# EAGLE design lp_prog (EAGLE 7.5.0)
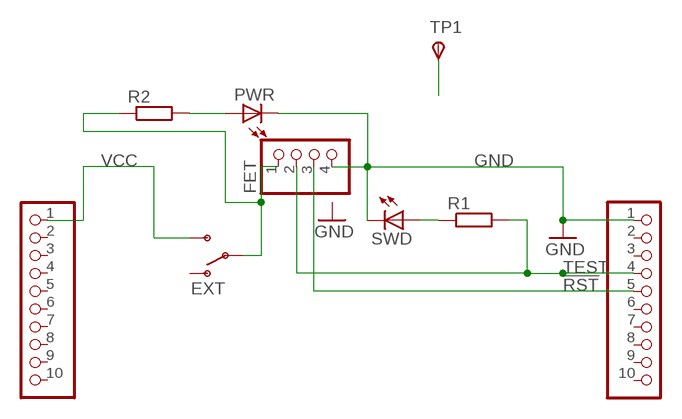
[diagram p0: schematic, sheet 1]

## Parts
FET  FET  PINHD-1X4  [1X04]
J1  J1  PINHD-1X10  [1X10]
J2  J2  PINHD-1X10  [1X10]
ON  EXT  SWITCH-SPSTPTH  [SWITCH-SPDT]
PWR  PWR  LEDCHIPLED_1206  [CHIPLED_1206]
R1  470  R-EU_R0805  [R0805]
R2  470  R-EU_R0805  [R0805]
SWD  SWD  LEDCHIPLED_1206  [CHIPLED_1206]
TP1  TPSTP20R  [TP20R]

## Nets
!RST: FET.3 J2.5
GND [GND]: FET.4 J2.1 PWR.C SWD.C
N$1: R1.1 SWD.A
N$2: PWR.A R2.2
N$4: TP1.TP(PP)
N$6 [VCC]: FET.1 ON.2(P) R2.1
TEST: FET.2 J2.4 R1.2
VCC [VCC]: J1.1 ON.3(S)
Unconnected: J1.2 J1.3 J1.4 J1.5 J1.6 J1.7 J1.8 J1.9 J1.10 J2.2 J2.3 J2.6 J2.7 J2.8 J2.9 J2.10 ON.1(O)

## Library data of the parts
FET = pinhead:PINHD-1X4: PIN HEADER
J1 J2 = pinhead:PINHD-1X10: PIN HEADER
ON = SparkFun:SWITCH-SPST: SPST Switch Simple slide switch. Spark Fun Electronics SKU : COM-00102
PWR SWD = led:LED: LED OSRAM: - CHIPLED LG R971, LG N971, LY N971, LG Q971, LY Q971, LO R971, LY R971 LH N974, LH R974 LS Q976, LO Q976, LY Q976 LO Q996 - Hyper CHIPLED LW Q18S LB Q993, LB Q99A, LB R99A - SideLED LS A670, LO A670, LY A670, LG A670, LP A670 LB A673, LV A673, LT A673, LW A673 LH A674 LY A675 LS A676, LA A676, LO A676, LY A676, LW A676 LS A679, LY A679, LG A679 - Hyper Micro SIDELED® LS Y876, LA Y876, LO Y876, LY Y876 LT Y87S - SmartLED LW L88C, LW L88S LB L89C, LB L89S, LG L890 LS L89K, LO L89K, LY L89K LS L896, LA L896, LO L896, LY L896 - TOPLED LS T670, LO T670, LY T670, LG T670, LP T670 LSG T670, LSP T670, LSY T670, LOP T670, LYG T670 LG T671, LOG T671, LSG T671 LB T673, LV T673, LT T673, LW T673 LH T674 LS T676, LA T676, LO T676, LY T676, LB T676, LH T676, LSB T676, LW T676 LB T67C, LV T67C, LT T67C, LS T67K, LO T67K, LY T67K, LW E67C LS E67B, LA E67B, LO E67B, LY E67B, LB E67C, LV E67C, LT E67C LW T67C LS T679, LY T679, LG T679 LS T770, LO T770, LY T770, LG T770, LP T770 LB T773, LV T773, LT T773, LW T773 LH T774 LS E675, LA E675, LY E675, LS T675 LS T776, LA T776, LO T776, LY T776, LB T776 LHGB T686 LT T68C, LB T68C - Hyper Mini TOPLED® LB M676 - Mini TOPLED Santana® LG M470 LS M47K, LO M47K, LY M47K Source: http://www.osram.convergy.de LUXEON: - LUMILED® LXK2-PW12-R00, LXK2-PW12-S00, LXK2-PW14-U00, LXK2-PW14-V00 LXK2-PM12-R00, LXK2-PM12-S00, LXK2-PM14-U00 LXK2-PE12-Q00, LXK2-PE12-R00, LXK2-PE12-S00, LXK2-PE14-T00, LXK2-PE14-U00 LXK2-PB12-K00, LXK2-PB12-L00, LXK2-PB12-M00, LXK2-PB14-N00, LXK2-PB14-P00, LXK2-PB14-Q00 LXK2-PR12-L00, LXK2-PR12-M00, LXK2-PR14-Q00, LXK2-PR14-R00 LXK2-PD12-Q00, LXK2-PD12-R00, LXK2-PD12-S00 LXK2-PH12-R00, LXK2-PH12-S00 LXK2-PL12-P00, LXK2-PL12-Q00, LXK2-PL12-R00 Source: www.luxeon.com KINGBRIGHT: KA-3528ASYC Source: www.kingbright.com
R1 R2 = resistor:R-EU_: RESISTOR, European symbol
TP1 = testpad:TPS: TEST PIN

## Net classes
0 default: width 0.508 mm, drill 0.508 mm
1 GND: width 0.813 mm, drill 0.508 mm
2 VCC: width 0.813 mm, drill 0.508 mm

## Board
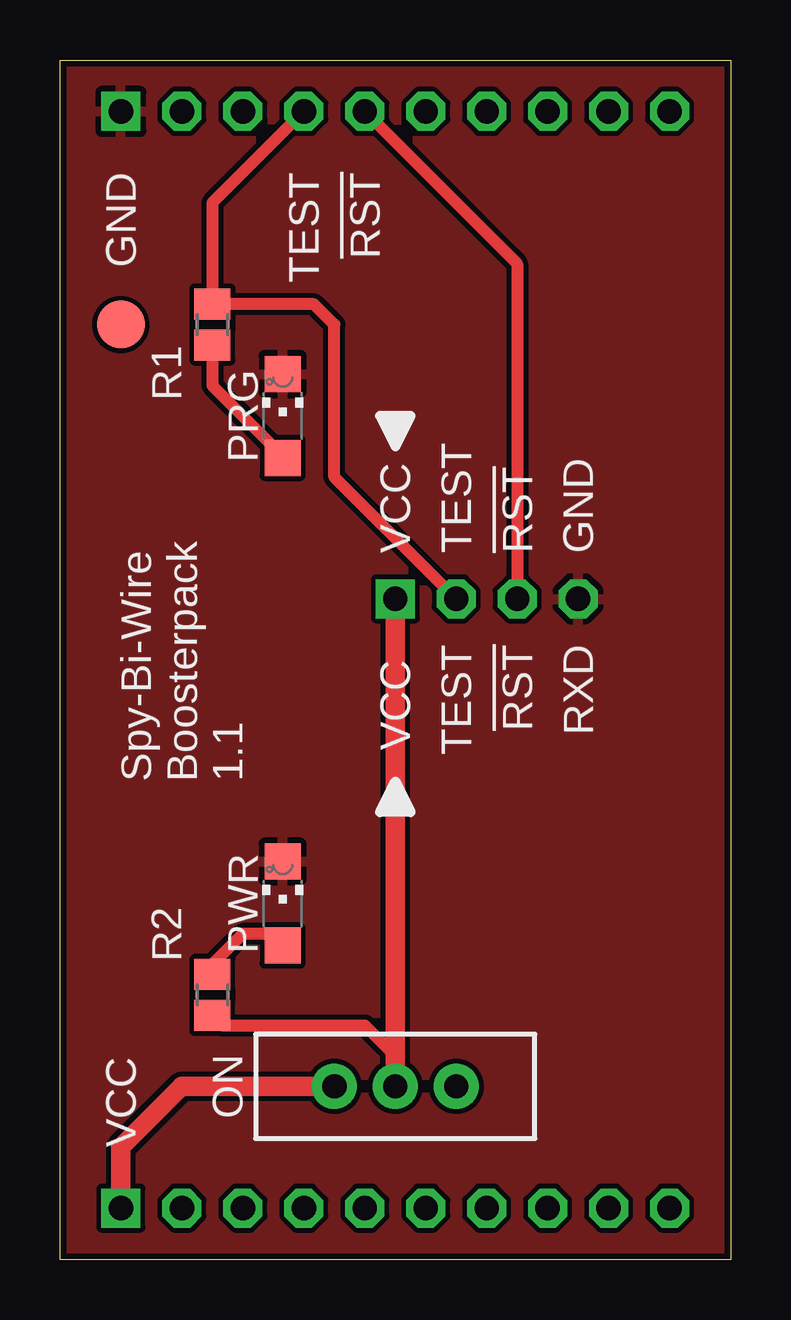
[diagram p1: board, top side]
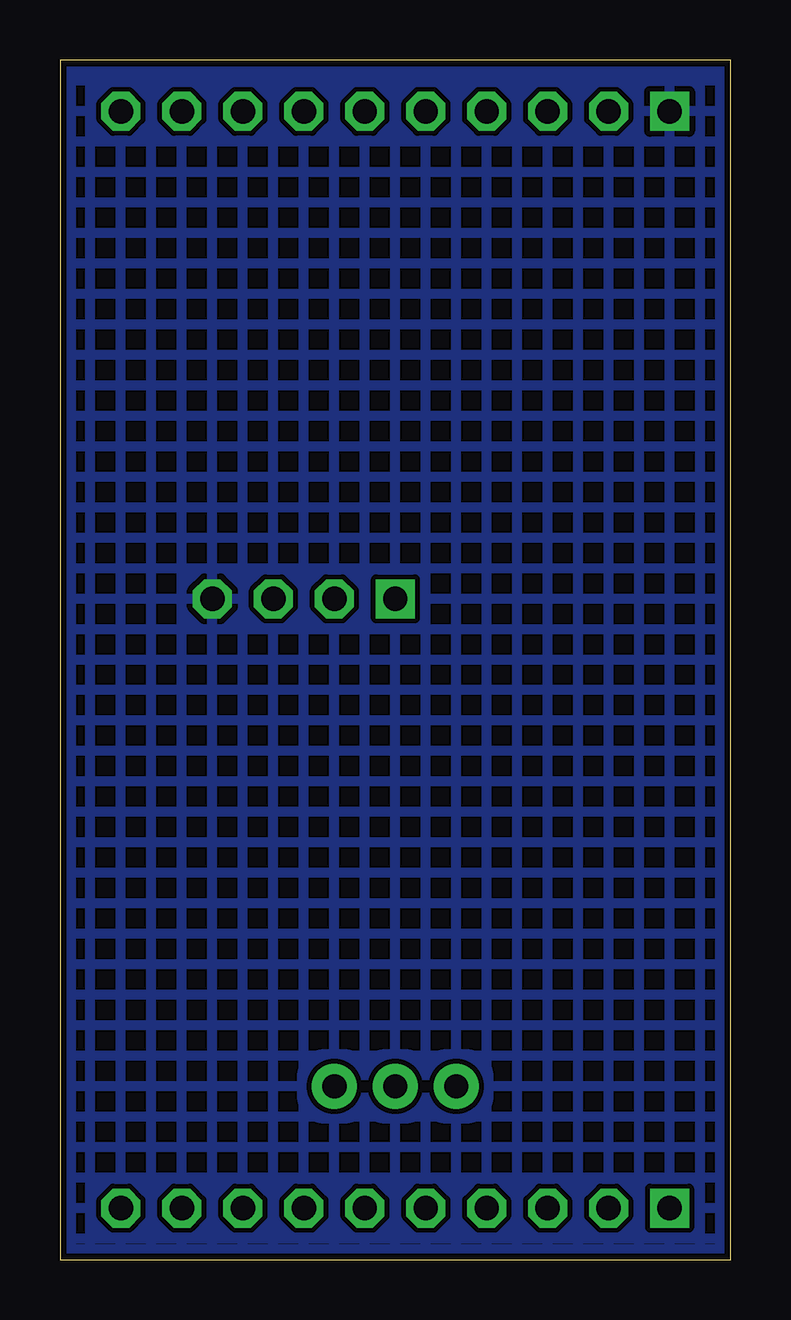
[diagram p2: board, bottom side, seen from below]

Size 27.94 x 50 mm. Coordinates in mm from the lower left corner, seen from the top.
Outline: 0,50 27.94,50 27.94,0 0,0 0,50
Copper layers (1*16): Top 0.035mm / dielectric 1.5mm / Bottom 0.035mm
Design rules "SparkFun *": minimum track width 20mil, minimum drill 20mil, track to track 8mil, track to pad 8mil, pad to pad 8mil, via to via 8mil, smd to smd 8mil, copper to edge 10mil, drill to drill 8mil, minimum pad ring 12mil, minimum via ring 10mil, stop-mask expansion 4mil, vias tented up to drill 25mil, thermal gap 10mil

### Footprints (pad centres in the part's own frame; a part is rotated, then mirrored left to right if it is on the bottom)
1X04 = drill 1.016 square: 1 -3.81,0 | drill 1.016 octagon: 2 -1.27,0; 3 1.27,0; 4 3.81,0
1X10 = drill 1.016 square: 1 -11.43,0 | drill 1.016 octagon: 2 -8.89,0; 3 -6.35,0; 4 -3.81,0; 5 -1.27,0; 6 1.27,0; 7 3.81,0; 8 6.35,0; 9 8.89,0; 10 11.43,0
SWITCH-SPDT = drill 1.016 pad 1.88: 1 0,2.54; 2 0,0; 3 0,-2.54
CHIPLED_1206 = smd 1.5 x 1.5: A 0,-1.75; C 0,1.75
R0805 = smd 1.3 x 1.5: 1 -0.85,0; 2 0.85,0
TP20R = smd 2 x 2: TP 0,0

### Placement (x,y rotation side)
FET  17.78,27.54 0 top
J1  13.97,2.14 0 top
J2  13.97,47.86 0 top
ON  13.97,7.22 270 top
PWR  9.28,14.84 0 top
R1  6.35,38.97 90 top
R2  6.35,11.03 90 top
SWD  9.28,35.16 0 top
TP1  2.54,38.97 0 top

### Tracks (layer width: path | path; a pad name or v marks a point on that pad's centre or on a via)
!RST
  Top 0.508: J2.5 19.05,41.51 FET.3
GND
  pour Bottom (hatched): -1.37,51.47 29.17,51.47 29.17,-1.67 -1.37,-1.77
  pour Top: -1.37,51.47 29.21,51.47 29.21,-1.67 -1.37,-1.77
N$1
  Top 0.508: SWD.A 8.89,33.89 6.35,36.43 6.35,37.7 R1.1
N$2
  Top 0.508: R2.2 6.35,12.3 7.62,13.57 8.89,13.57 PWR.A
N$6
  Top 0.508: R2.1 6.77,9.76 12.7,9.76 13.97,8.49
  Top 0.818: ON.2 13.97,7.86 13.97,8.49 FET.1
TEST
  Top 0.508: FET.2 11.43,32.62 11.43,38.97 10.58,39.82 R1.2 6.35,44.05 J2.4
VCC
  Top 0.818: ON.3 5.08,7.22 2.54,4.68 J1.1

### Text on the board
tNames: GND | TEST | !RST | PRG | VCC | TEST | !RST | GND | TEST | !RST | RXD | VCC | Spy-Bi-Wire / Boosterpack / 1.1 | PWR | ON | VCC